# Altium schematic sheet PumpkinV1.SchDoc
size A4
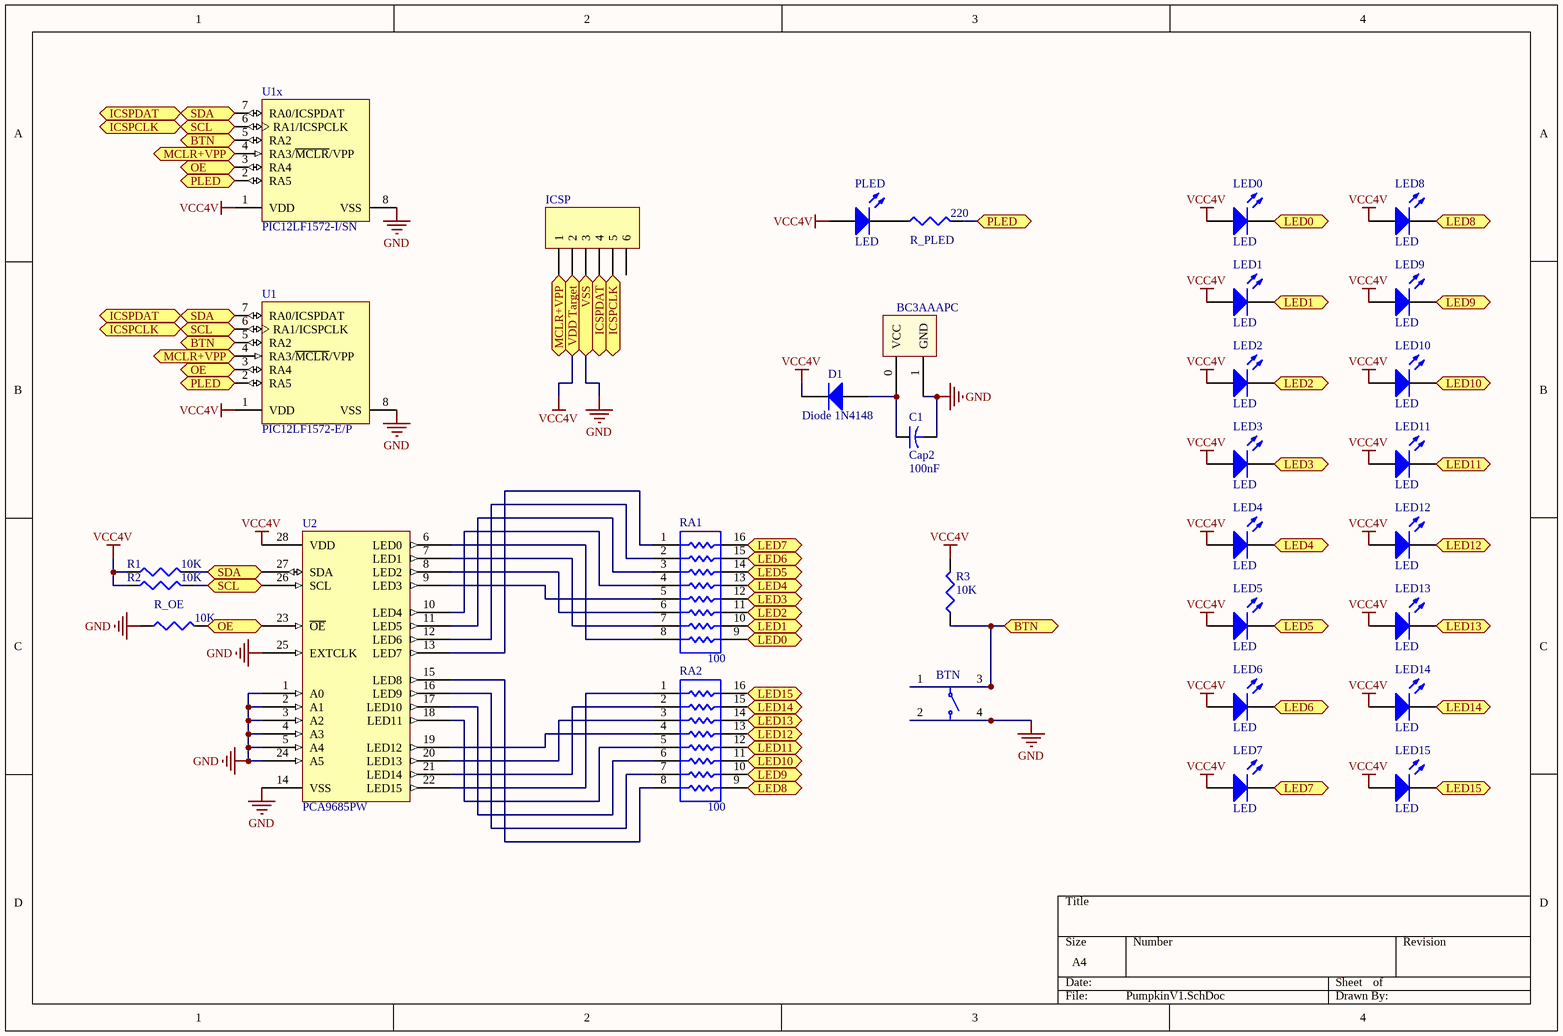
[diagram p0: PumpkinV1.SchDoc]

## Parts
*  BC3AAAPC  [BC3AAAPC]
BTN  430156043726  [4301x60437x6]  (value not drawn)
C1  Cap2  value 100nF  [CAPR5-4X5]
D1  Diode 1N4148  [DO-35]
ICSP  Header 6H  [HDR1X6H]  (value not drawn)
LED0  LED  [1608[0603]]
LED1  LED  [1608[0603]]
LED2  LED  [1608[0603]]
LED3  LED  [1608[0603]]
LED4  LED  [1608[0603]]
LED5  LED  [1608[0603]]
LED6  LED  [1608[0603]]
LED7  LED  [1608[0603]]
LED8  LED  [1608[0603]]
LED9  LED  [1608[0603]]
LED10  LED  [1608[0603]]
LED11  LED  [1608[0603]]
LED12  LED  [1608[0603]]
LED13  LED  [1608[0603]]
LED14  LED  [1608[0603]]
LED15  LED  [1608[0603]]
PLED  LED  [1608[0603]]
R1  value 10K  [2012[0805]]  (hidden comment: Res3)
R2  value 10K  [2012[0805]]  (hidden comment: Res3)
R3  value 10K  [2012[0805]]  (hidden comment: Res3)
R_OE  value 10K  [2012[0805]]  (hidden comment: Res3)
R_PLED  value 220  [2012[0805]]  (hidden comment: Res3)
RA1  value 100  [EXB2HV]  (hidden comment: Res Pack3)
RA2  value 100  [EXB2HV]  (hidden comment: Res Pack3)
U1  PIC12LF1572-E/P  [MCHP-PDIP-P8]
U1x  PIC12LF1572-I/SN  [MCHP-SOIC-SN8_N]
U2  PCA9685PW  [TSSOP28]

## Ports
BTN, ICSPCLK, ICSPDAT, LED0, LED1, LED2, LED3, LED4, LED5, LED6, LED7, LED8, LED9, LED10, LED11, LED12, LED13, LED14, LED15, MCLR+VPP, OE, PLED, SCL, SDA, VDD Target, VSS

## Nets
GND: *.1(GND) BTN.2 BTN.4 C1.2 ICSP.3 R_OE.1 U1.8(VSS) U1x.8(VSS) U2.1(A0) U2.2(A1) U2.3(A2) U2.4(A3) U2.5(A4) U2.14(VSS) U2.24(A5) U2.25(EXTCLK) ; port VSS
VCC4V: D1.2(K) ICSP.2 LED0.1(A) LED1.1(A) LED2.1(A) LED3.1(A) LED4.1(A) LED5.1(A) LED6.1(A) LED7.1(A) LED8.1(A) LED9.1(A) LED10.1(A) LED11.1(A) LED12.1(A) LED13.1(A) LED14.1(A) LED15.1(A) PLED.1(A) R1.1 R2.1 R3.2 U1.1(VDD) U1x.1(VDD) U2.28(VDD) ; port VDD Target
BTN: BTN.1 BTN.3 R3.1 U1.5(RA2) U1x.5(RA2) ; port BTN
ICSPCLK: ICSP.5 R2.2 U1.6(RA1/ICSPCLK) U1x.6(RA1/ICSPCLK) U2.26(SCL) ; port SCL, port ICSPCLK
ICSPDAT: ICSP.4 R1.2 U1.7(RA0/ICSPDAT) U1x.7(RA0/ICSPDAT) U2.27(SDA) ; port SDA, port ICSPDAT
LED0: LED0.2(K) RA1.9 ; port LED0
LED1: LED1.2(K) RA1.10 ; port LED1
LED2: LED2.2(K) RA1.11 ; port LED2
LED3: LED3.2(K) RA1.12 ; port LED3
LED4: LED4.2(K) RA1.13 ; port LED4
LED5: LED5.2(K) RA1.14 ; port LED5
LED6: LED6.2(K) RA1.15 ; port LED6
LED7: LED7.2(K) RA1.16 ; port LED7
LED8: LED8.2(K) RA2.9 ; port LED8
LED9: LED9.2(K) RA2.10 ; port LED9
LED10: LED10.2(K) RA2.11 ; port LED10
LED11: LED11.2(K) RA2.12 ; port LED11
LED12: LED12.2(K) RA2.13 ; port LED12
LED13: LED13.2(K) RA2.14 ; port LED13
LED14: LED14.2(K) RA2.15 ; port LED14
LED15: LED15.2(K) RA2.16 ; port LED15
MCLR+VPP: ICSP.1 U1.4(RA3/~{MCLR}/VPP) U1x.4(RA3/~{MCLR}/VPP) ; port MCLR+VPP
OE: R_OE.2 U1.3(RA4) U1x.3(RA4) U2.23(~{OE}) ; port OE
PLED: R_PLED.2 U1.2(RA5) U1x.2(RA5) ; port PLED
Net*_0: *.0(VCC) C1.1 D1.1(A)
NetPLED_2: PLED.2(K) R_PLED.1
NetRA1_1: RA1.1 U2.13(LED7)
NetRA1_2: RA1.2 U2.12(LED6)
NetRA1_3: RA1.3 U2.11(LED5)
NetRA1_4: RA1.4 U2.10(LED4)
NetRA1_5: RA1.5 U2.9(LED3)
NetRA1_6: RA1.6 U2.8(LED2)
NetRA1_7: RA1.7 U2.7(LED1)
NetRA1_8: RA1.8 U2.6(LED0)
NetRA2_1: RA2.1 U2.22(LED15)
NetRA2_2: RA2.2 U2.21(LED14)
NetRA2_3: RA2.3 U2.20(LED13)
NetRA2_4: RA2.4 U2.19(LED12)
NetRA2_5: RA2.5 U2.18(LED11)
NetRA2_6: RA2.6 U2.17(LED10)
NetRA2_7: RA2.7 U2.16(LED9)
NetRA2_8: RA2.8 U2.15(LED8)

Not connected (* = marked no-connect by the designer): ICSP 6

## Library data of the parts
* = BC3AAAPC: AAA Battery Holder, 3 Cell
BTN = WS-TATV, 430156043726: WS-TATV 6x6 mm THT; Manufacturer: Wurth Elektronik; partNo: 430156043726; ComponentLink1Description: Manufacturer; ComponentLink1URL: http://www.we-online.de; Created by: Baojun Chen; Created Date: Dec.2015; ComponentLink2Description: Datasheet; ComponentLink2URL: http://katalog.we-online.de/em/datasheet/4301x6xxx7x6.pdf
C1 = Cap2: Capacitor; Published: 23-Sep-2002; PackageReference: CAPR5-4X5; Publisher: Altium Limited; PackageDescription: Capacitor; 2 Leads
D1 = Diode 1N4148: High Conductance Fast Diode; Published: 8-Jun-2000; LatestRevisionDate: 17-Jul-2002; LatestRevisionNote: Re-released for DXP Platform.; DatasheetVersion: 1997; PackageReference: DO-35; Publisher: Altium Limited; PackageDescription: Diode, Axial; Body 3.8 x 1.9 mm (LxDia. max), Lead Dia. 0.53 mm (max); Code_JEDEC: DO-204-AH; ComponentLink1Description: Manufacturer Link; ComponentLink1URL: http://www.fairchildsemi.com/; ComponentLink2Description: Datasheet; ComponentLink2URL: http://www.fairchildsemi.com/ds/1N%2F1N4148.pdf
ICSP = Header 6H: Header, 6-Pin, Right Angle; LatestRevisionDate: 17-Jul-2002; LatestRevisionNote: Re-released for DXP Platform.; Publisher: Altium Limited
LED0-LED15 PLED = LED2: Typical RED, GREEN, YELLOW, AMBER GaAs LED; Published: 8-Jun-2000; LatestRevisionDate: 17-Jul-2002; LatestRevisionNote: Re-released for DXP Platform.; PackageVersion: Feb-2002; PackageReference: 3.2X1.6X1.1; Publisher: Altium Limited; PackageDescription: SM LED; 2 Flat Leads
R1-R3 R_OE R_PLED = Res3: Resistor; Published: 8-Jun-2000; LatestRevisionDate: 29-May-2009; LatestRevisionNote: IPC-7351 Footprint Added.; PackageReference: J1-0603; Publisher: Altium Limited; PackageDescription: Chip Resistor
RA1 RA2 = Res Pack3: Isolated Resistor Network; Published: 24-Mar-1999; LatestRevisionDate: 29-May-2009; LatestRevisionNote: IPC-7351 Footprint Added.; PackageReference: SO-16; Publisher: Altium Limited; PackageDescription: 16-Pin Small Outline Integrated Circuit 1.27 mm Pitch; Code_JEDEC: MS-012-AC; Code_IPC: SOIC127P600-16
U1 = PIC12LF1572-E/P: Microcontroller with High Precision 16-Bit PWMs, 2K (x14-Bit words) Program Memory, 256 Bytes SRAM, 6 I/O, Extended Temperature, 8-Pin PDIP (P8), Tube; Manufacturer: Microchip; VCC Range: 1.8 to 3.6 V; DatasheetVersion: Rev. A; PackageVersion: C04-018B, 12/2012; PackageReference: PDIP-P8; PackageDescription: 8-Lead Plastic Dual In-Line, Row Spacing 7.62 mm, 9.5 x 6.6 mm Body, 2.54 mm Pitch; Supplier 1: Digi-Key; Supplier Part Number 1: PIC12LF1572-E/P-ND; Supplier 2: Newark; Supplier Part Number 2: 19X8930; Supplier 3: Mouser; Supplier Part Number 3: 579-PIC12LF1572-E/P; Packing: Tube; Mounting Technology: Through Hole; PartNumber: PIC12LF1572-E/P; ComponentLink1Description: Manufacturer URL; ComponentLink1URL: http://www.microchip.com/; ComponentLink2Description: Datasheet; ComponentLink2URL: http://ww1.microchip.com/downloads/en/DeviceDoc/40001723A.pdf; ComponentLink3Description: Package Specification; ComponentLink3URL: http://www.microchip.com/stellent/groups/techpub_sg/documents/packagingspec/en012702.pdf
U1x = PIC12LF1572-I/SN: Microcontroller with High Precision 16-Bit PWMs, 2K (x14-Bit words) Program Memory, 256 Bytes SRAM, 6 I/O, Industrial Temperature, 8-Pin SOIC (SN8), Tube; Manufacturer: Microchip; VCC Range: 1.8 to 3.6 V; DatasheetVersion: Rev. A; PackageVersion: C04-057C, 12/2012; PackageReference: SOIC-SN8; PackageDescription: 8-Lead Plastic Small Outline, 4.9 x 3.9 mm Body, 1.27 mm Pitch; Supplier 1: Digi-Key; Supplier Part Number 1: PIC12LF1572-I/SN-ND; Supplier 2: Newark; Supplier Part Number 2: 17X9233; Supplier 3: Mouser; Supplier Part Number 3: 579-PIC12LF1572-I/SN; Packing: Tube; Mounting Technology: Surface Mount; PartNumber: PIC12LF1572-I/SN; ComponentLink1Description: Manufacturer URL; ComponentLink1URL: http://www.microchip.com/; ComponentLink2Description: Datasheet; ComponentLink2URL: http://ww1.microchip.com/downloads/en/DeviceDoc/40001723A.pdf; ComponentLink3Description: Package Specification; ComponentLink3URL: http://ww1.microchip.com/downloads/en/DeviceDoc/20002122B.pdf
U2 = PCA9685PW: IC LED DRIVER RGBA 28-TSSOP; Manufacturer: NXP; Name: PCA9685PW